# Altium schematic sheet High-Side Driver.SchDoc
size A4; SheetNumber: 9; SheetTotal: 9
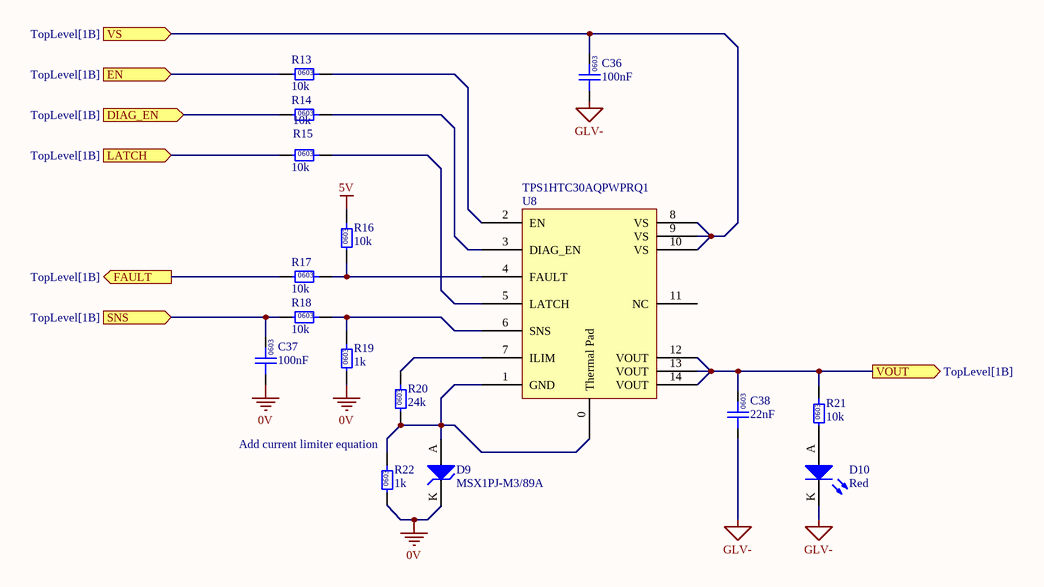
[diagram p0: High-Side Driver.SchDoc]

## Parts
C36  100nF  [0603]
C37  100nF  [0603]
C38  22nF  [0603]
D9  MSX1PJ-M3/89A  [VISHAY DO-219]
D10  Red  [0805 LED]
R13  10k  [0603]
R14  10k  [0603]
R15  10k  [0603]
R16  10k  [0603]
R17  10k  [0603]
R18  10k  [0603]
R19  1k  [0603]
R20  24k  [0603]
R21  10k  [0603]
R22  1k  [0603]
U8  TPS1HTC30AQPWPRQ1  [TI_14_TSSOP]

## Ports
DIAG_EN (in, see TopLevel[1B]), EN (in, see TopLevel[1B]), FAULT (out, see TopLevel[1B]), LATCH (in, see TopLevel[1B]), SNS (in, see TopLevel[1B]), VOUT (out, see TopLevel[1B]), VS (in, see TopLevel[1B])

## Nets
0V: C37.1 D9.K R19.1 R22.1
5V: R16.2
GLV-: C36.1 C38.1 D10.K
DIAG_EN: R14.1 ; port DIAG_EN
EN: R13.1 ; port EN
FAULT: R17.1 ; port FAULT
LATCH: R15.1 ; port LATCH
SNS: C37.2 R18.1 ; port SNS
VOUT: C38.2 R21.2 U8.12(VOUT) U8.13(VOUT) U8.14(VOUT) ; port VOUT
VS: C36.2 U8.8(VS) U8.9(VS) U8.10(VS) ; port VS
NetD9_A: D9.A R20.1 R22.2 U8.0(Thermal_Pad) U8.1(GND)
NetD10_A: D10.A R21.1
NetR13_2: R13.2 U8.2(EN)
NetR14_2: R14.2 U8.3(DIAG_EN)
NetR15_2: R15.2 U8.5(LATCH)
NetR16_1: R16.1 R17.2 U8.4(FAULT)
NetR18_2: R18.2 R19.2 U8.6(SNS)
NetR20_2: R20.2 U8.7(ILIM)

Not connected (* = marked no-connect by the designer): U8 11(NC)

## Notes on the sheet
- (near R22) Add current limiter equation
- (in symbol GCM188L81H104KA57D) 0603
- (in symbol GCM188R71H223KA37J) 0603
- (in symbol RC0603FR-7W24KL) 0603
- (in symbol RC0603FR-071KL) 0603
- (in symbol RC0603FR-0710KL) 0603

## Library data of the parts
C36 C37 = GCM188L81H104KA57D: Manufacturer: muRata; Rated Voltage: 50V; Tolerance: ±10%; Material: MLCC; Temperature Rating: X8L; Part Number: GCM188L81H104KA57D; Value: 100nF; Digikey Part Number: 490-6049-1-ND
C38 = GCM188R71H223KA37J: Manufacturer: Murata Electronics; Rated Voltage: 50V; Tolerance: ±10%; Material: MLCC; Temperature Rating: X7R; Part Number: GCM188R71H223KA37J; Value: 22nF; Digikey Part Number: 490-8022-2-ND
D9 = MSX1PJ-M3/89A: Manufacturer: Vishay General Semiconductor - Diodes Division; Breakdown Voltage: 600V; Part Number: MSX1PJ-M3/89A
D10 = SML-210LTT86: Red LED Indication - Discrete 1.75V 0805 (2012 Metric); Manufacturer: ROHM Semiconductor; Part Number: SML-210LTT86; Colour: Red; Digikey Part Number: 511-1286-1-ND
R13-R18 R21 = RC0603FR-0710KL: Manufacturer: YAGEO; Tolerance: 0.01; Rated Power: 0.1W; Part Number: RC0603FR-0710KL; Value: 10k; Material: FR-07; Digikey Part Number: 311-10.0KHRCT-ND
R19 R22 = RC0603FR-071KL: Manufacturer: YAGEO; Tolerance: 0.01; Rated Power: 0.1W; Part Number: RC0603FR-071KL; Value: 1k; Material: FR-07; Digikey Part Number: 311-1.00KHRCT-ND
R20 = RC0603FR-7W24KL: Manufacturer: YAGEO; Tolerance: 0.01; Rated Power: 0.2W; Part Number: RC0603FR-7W24KL; Value: 24k; Digikey Part Number: 13-RC0603FR-7W24KL-ND
U8 = TPS1HTC30AQPWPRQ1: AUTOMOTIVE, 60-V, 6-A, 30-M, ONE; Part Number: TPS1HTC30AQPWPRQ1